# Altium schematic sheet DAC.SchDoc: DAC
size Letter; CheckedBy: J. Brinton; CompanyName: Signal Laboratories, Inc.; DrawnBy: J. Brinton; Engineer: J. Brinton; Address1: 3479 Edison Way; Address2: Menlo Park CA 94025; Address3: +1 (877) 778-8435; Address4: siglabs.com; Revision: 3; SheetNumber: 24; SheetTotal: 49; ModifiedDate: 4/20/2018
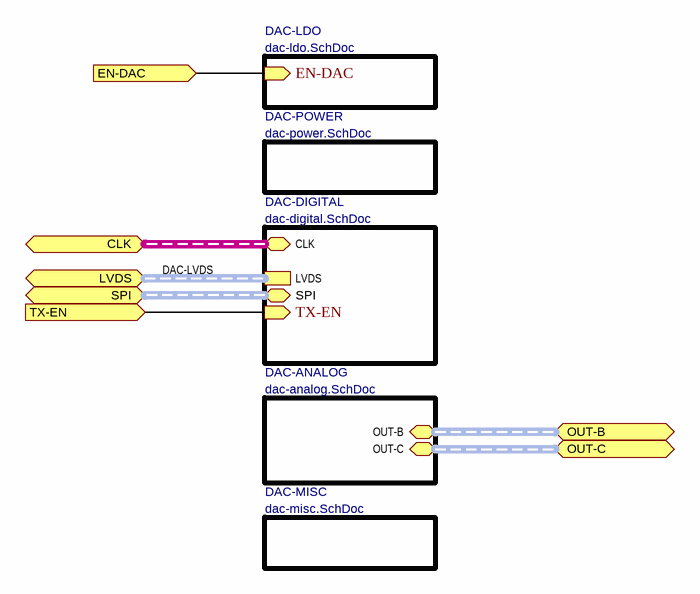
[diagram p0: DAC.SchDoc]

## Sub-sheets
DAC-ANALOG = dac-analog.SchDoc: OUT-B (harness DIFF100), OUT-C (harness DIFF100)
DAC-DIGITAL = dac-digital.SchDoc: LVDS (harness DAC-LVDS), CLK (harness CLK-LVPECL33-TERM), SPI (harness SPI-3V3), TX-EN (in)
DAC-LDO = dac-ldo.SchDoc: EN-DAC (in)
DAC-MISC = dac-misc.SchDoc: no entries
DAC-POWER = dac-power.SchDoc: no entries

## Ports
CLK (harness CLK-LVPECL33-TERM), EN-DAC (in), LVDS (harness DAC-LVDS), OUT-B (harness DIFF100), OUT-C (harness DIFF100), SPI (harness SPI-3V3), TX-EN (in)

## Nets
EN-DAC: port EN-DAC, sheet DAC-LDO/EN-DAC
TX-EN: port TX-EN, sheet DAC-DIGITAL/TX-EN

## Buses and harness runs
harness DAC-LVDS = port LVDS = sheet DAC-DIGITAL/LVDS
harness port CLK = sheet DAC-DIGITAL/CLK
harness port OUT-B = sheet DAC-ANALOG/OUT-B
harness port OUT-C = sheet DAC-ANALOG/OUT-C
harness port SPI = sheet DAC-DIGITAL/SPI

## Notes on the sheet
- Title
- Engineer
- Revision
- Drawn By
- Checked By
- Date
- Sheet
- of